# Altium schematic sheet llrf_afe_system_ctrl.SchDoc: =GlobalProjectName
size 209 x 297 mm; SheetNumber: 14; SheetTotal: 17; PageSetup: Record=PageOptions|CenterHorizontal=True|CenterVertical=True|PrintScale=1.00|XCorrection=1.00|YCorrection=1.00|PrintKind=1|BorderSize=5000000|LeftOffset=0|BottomOffset=0|Orientation=2|PaperLength=1000|PaperWidth=1000|Scale=100|PaperSource=15|PrintQuality=1200|MediaType=1|DitherType=10|PaperKind=A3|PrintScaleMode=1; Weight: -; ScaleFactor: -
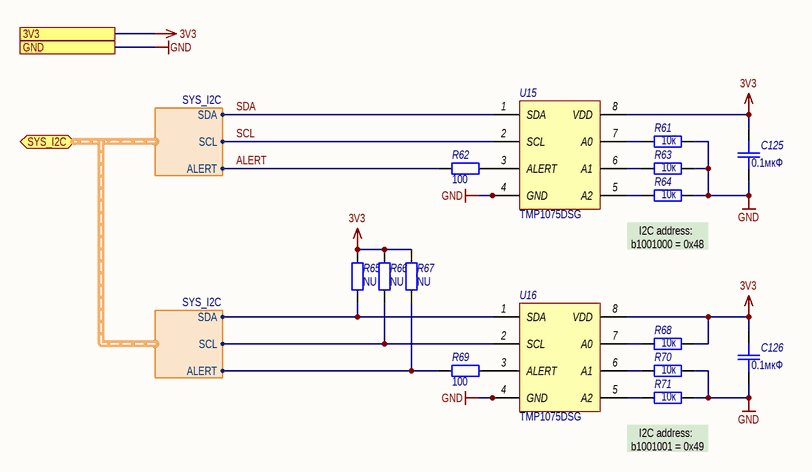
[diagram p0: llrf_afe_system_ctrl.SchDoc]

## Parts
C125  0.1мкФ  [SMD_C0402]
C126  0.1мкФ  [SMD_C0402]
R61  10к  [SMD_0603]
R62  100  [SMD_0603]
R63  10к  [SMD_0603]
R64  10к  [SMD_0603]
R65  NU  [SMD_0603]
R66  NU  [SMD_0603]
R67  NU  [SMD_0603]
R68  10к  [SMD_0603]
R69  100  [SMD_0603]
R70  10к  [SMD_0603]
R71  10к  [SMD_0603]
U15  TMP1075DSG  [WSON-8]
U16  TMP1075DSG  [WSON-8]

## Ports
3V3, GND, SYS_I2C (bidir, harness SYS_I2C)

## Harnesses
SYS_I2C: SDA, SCL, ALERT

## Nets
3V3: C125.2 C126.2 R65.1 R66.1 R67.1 R68.2 U15.8(VDD) U16.8(VDD) ; port 3V3
GND: C125.1 C126.1 R61.2 R63.2 R64.2 R70.2 R71.2 U15.4(GND) U15.9(GND) U16.4(GND) U16.9(GND) ; port GND
ALERT: R62.1 R67.2 R69.1 ; port SYS_I2C.ALERT
SCL: R66.2 U15.2(SCL) U16.2(SCL) ; port SYS_I2C.SCL
SDA: R65.2 U15.1(SDA) U16.1(SDA) ; port SYS_I2C.SDA
NetR61_1: R61.1 U15.7(A0)
NetR62_2: R62.2 U15.3(ALERT)
NetR63_1: R63.1 U15.6(A1)
NetR64_1: R64.1 U15.5(A2)
NetR68_1: R68.1 U16.7(A0)
NetR69_2: R69.2 U16.3(ALERT)
NetR70_1: R70.1 U16.6(A1)
NetR71_1: R71.1 U16.5(A2)

## Notes on the sheet
- I2C address:
  b1001000 = 0x48
- I2C address:
  b1001001 = 0x49
- Подп. и дата
- Инв. № дубл.
- Взам. инв. №
- Инв. № подл.
- Изм.
- Лист
- № докум.
- Подп.
- Дата
- Форма 2а ГОСТ 2.104-2006
- Копировал
- Формат А4

## Library data of the parts
C125 C126 = Capacitor: Назначение: SMD-конденсатор; Наименование: Конденсатор; Потребление, Вт: 0; Value: 0.1мкФ
R61-R71 = Resistor: Наименование: Резистор; Назначение: SMD-резистор; Потребление, Вт: 0,001
  R61 R63 R64 R68 R70 R71: Value: 10к
  R62 R69: Value: 100
  R65-R67: Value: NU
U15 U16 = TMP1075DSG: TMP1075 Temperature Sensor With I2C and SMBus Interface; Назначение: Датчик температуры I2C; Потребление, Вт: 0,001; ComponentLink1Description: DataSheet; ComponentLink1URL: https://www.ti.com/lit/gpn/tmp1075; Наименование: TMP1075DSG